# EAGLE schematic me433hw2 (EAGLE 9.3.0)
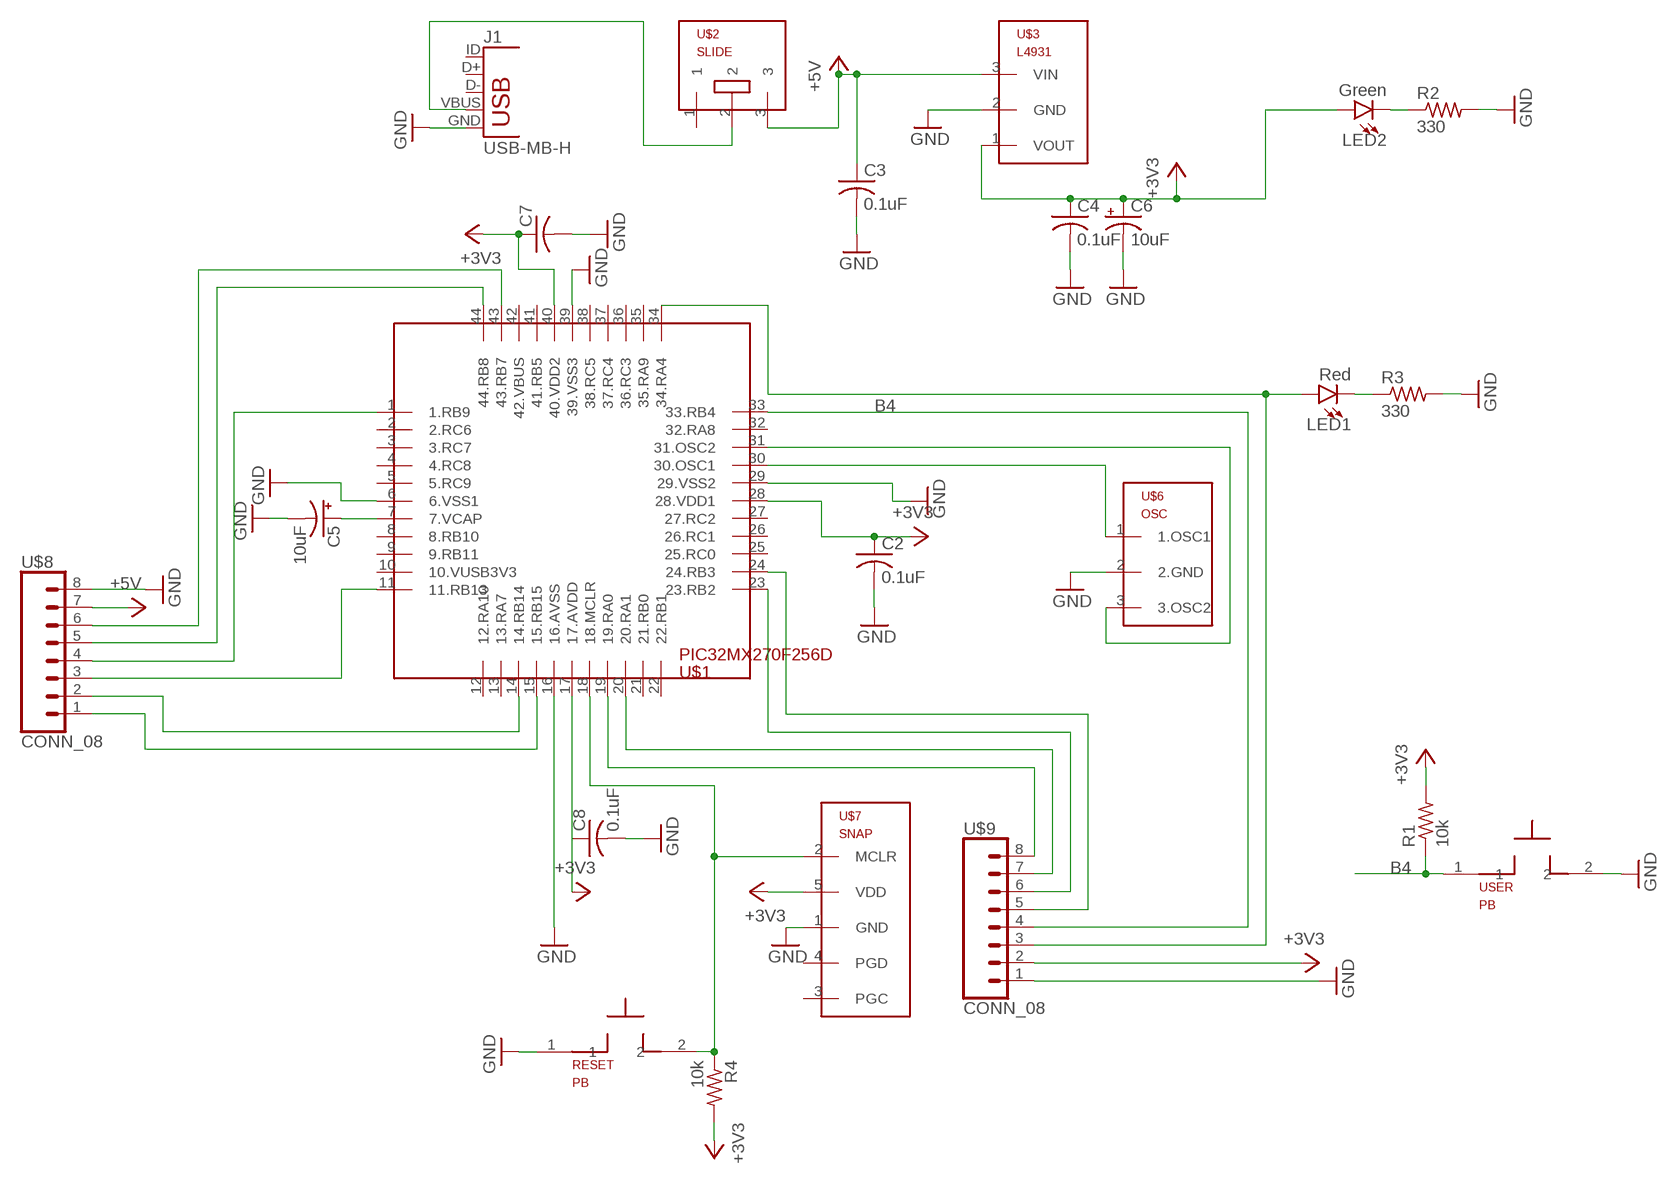
[diagram p0: schematic, sheet 1]

## Parts
C2  0.1uF  C-US025-025X050  [C025-025X050]
C3  0.1uF  C-US025-025X050  [C025-025X050]
C4  0.1uF  C-US025-025X050  [C025-025X050]
C5  10uF  CPOL-USB45181B  [B45181B]
C6  10uF  CPOL-USB45181B  [B45181B]
C7  C-US025-025X050  [C025-025X050]
C8  0.1uF  C-US025-025X050  [C025-025X050]
J1  USB-MB-H  [USB-MB-H]
LED1  Red  LED3MM  [LED_3MM]
LED2  Green  LED3MM  [LED_3MM]
R1  10k  R-US_0207/10  [0207/10]
R2  330  R-US_0207/10  [0207/10]
R3  330  R-US_0207/10  [0207/10]
R4  10k  R-US_0207/10  [0207/10]
RESET  PB  [PB]
U$1  PIC32MX270F256D  [TQFP44]
U$2  SLIDE  [SLIDE]
U$3  L4931  [TO92]
U$6  OSC  [OSC]
U$7  SNAP  [1X05]
U$8  CONN_08  [1X08]
U$9  CONN_08  [1X08]
USER  PB  [PB]

## Nets
+3V3: C2.1 C4.1 C6.+ C7.1 LED2.A R1.2 R4.2 U$1.28(28.VDD1) U$1.40(40.VDD2) U$3.1(VOUT) U$7.5(VDD) U$9.2
+5V: C3.1 U$2.3 U$3.3(VIN) U$8.7
B4: R1.1 U$1.33(33.RB4) U$9.4 USER.1
GND: C2.2 C3.2 C4.2 C5.- C6.- C7.2 C8.2 J1.GND R2.2 R3.2 RESET.1 U$1.6(6.VSS1) U$1.16(16.AVSS) U$1.29(29.VSS2) U$1.39(39.VSS3) U$3.2(GND) U$6.2(2.GND) U$7.1(GND) U$8.8 U$9.1 USER.2
N$1: U$1.31(31.OSC2) U$6.3(3.OSC2)
N$2: U$1.30(30.OSC1) U$6.1(1.OSC1)
N$3: J1.VBUS U$2.2
N$4: R4.1 RESET.2 U$1.18(18.MCLR) U$7.2(MCLR)
N$5: LED2.K(C) R2.1
N$6: LED1.K(C) R3.1
N$7: C5.+ U$1.7(7.VCAP)
N$8: C8.1 U$1.17(17.AVDD) ; supply symbol labelled +3V3
N$9: U$1.19(19.RA0) U$9.8
N$10: U$1.20(20.RA1) U$9.7
N$11: U$1.23(23.RB2) U$9.6
N$12: U$1.24(24.RB3) U$9.5
N$14: LED1.A U$1.34(34.RA4) U$9.3
N$15: U$1.43(43.RB7) U$8.6
N$16: U$1.44(44.RB8) U$8.5
N$17: U$1.1(1.RB9) U$8.4
N$18: U$1.11(11.RB13) U$8.3
N$19: U$1.14(14.RB14) U$8.2
N$20: U$1.15(15.RB15) U$8.1
Unconnected: J1.D+ J1.D- J1.ID U$1.2(2.RC6) U$1.3(3.RC7) U$1.4(4.RC8) U$1.5(5.RC9) U$1.8(8.RB10) U$1.9(9.RB11) U$1.10(10.VUSB3V3) U$1.12(12.RA10) U$1.13(13.RA7) U$1.21(21.RB0) U$1.22(22.RB1) U$1.25(25.RC0) U$1.26(26.RC1) U$1.27(27.RC2) U$1.32(32.RA8) U$1.35(35.RA9) U$1.36(36.RC3) U$1.37(37.RC4) U$1.38(38.RC5) U$1.41(41.RB5) U$1.42(42.VBUS) U$2.1 U$7.3(PGC) U$7.4(PGD)

## Library data of the parts
C2-C4 C7 C8 = me433hw2:C-US: CAPACITOR, American symbol; SPICEPREFIX: C
C5 C6 = me433hw2:CPOL-US: POLARIZED CAPACITOR, American symbol; SPICEPREFIX: C
J1 = me433hw2:USB: USB Connectors USB-B-PTH is fully proven SKU : PRT-00139/CONN-08278 USB-miniB is fully proven SKU : PRT-00587 USB-A-PCB is untested. USB-A-H is throughly reviewed, but untested. Spark Fun Electronics SKU : PRT-00437 USB-B-SMT is throughly reviewed, but untested. Needs silkscreen touching up. USB-A-S has not been used/tested USB-MB-H has not been used/tested USB-MICROB has been used. CONN-09505
LED1 LED2 = me433hw2:LED: LED (Generic) Standard schematic elements and footprints for 5mm, 3mm, 1206, and 0603 sized LEDs. Generic LEDs with no color specified.; PROD_ID: DIO-08794
R1-R4 = me433hw2:R-US_: RESISTOR, American symbol; SPICEPREFIX: R
RESET USER = me433hw2:PB
U$1 = me433hw2:PIC32MX270F256D
U$2 = me433hw2:SLIDE
U$3 = me433hw2:L4931
U$6 = me433hw2:OSC
U$7 = me433hw2:SNAP
U$8 U$9 = me433hw2:CONN_08